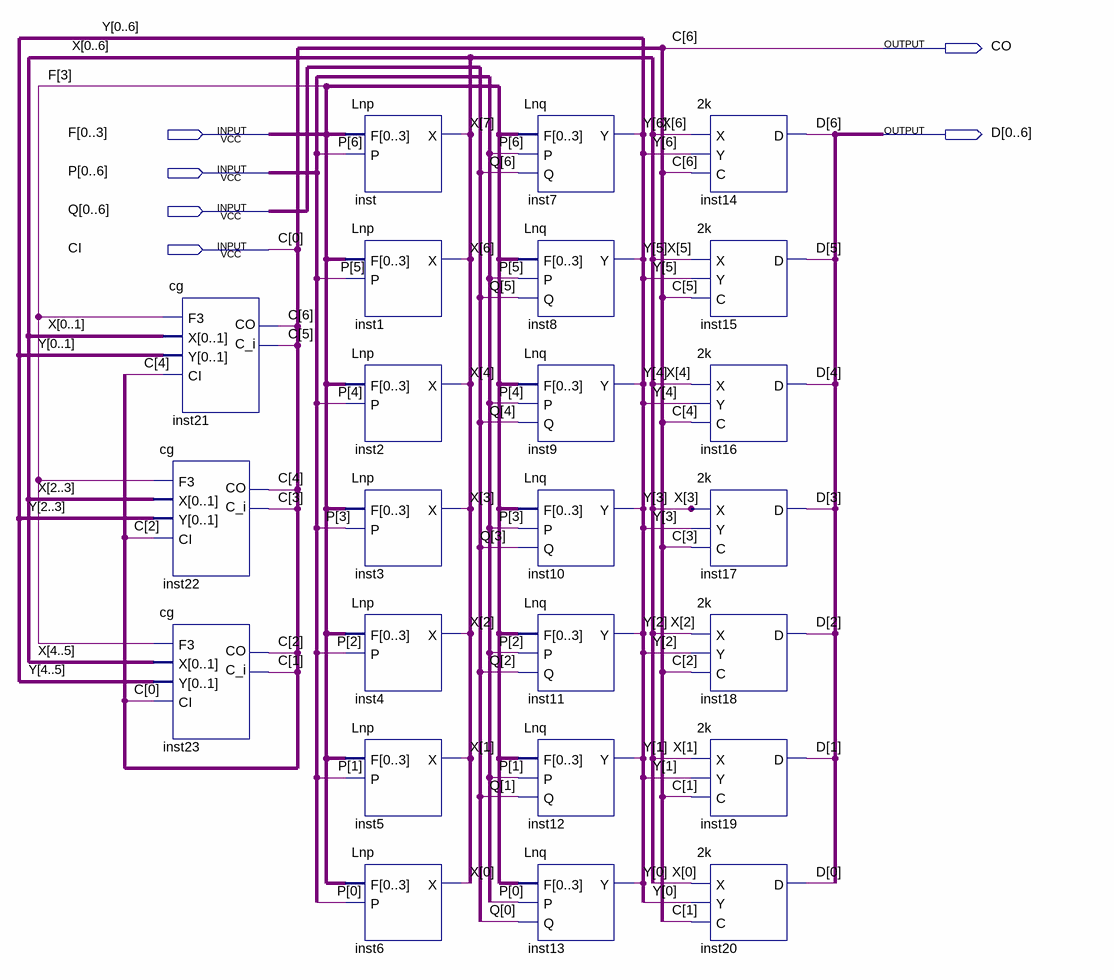
[diagram p0: schematic sheet]
// Quartus schematic lsm_7.bdf as structural Verilog: 24 symbols, 6 pins
module lsm_7 (
  input  [0:3] F,
  input  [0:6] P,
  input  [0:6] Q,
  input  CI,
  output CO,
  output [0:6] D
);

  wire [5:1] C;
  wire [6:0] Y;
  wire [7:0] X;

  cg inst21 (.F3(F[3]), .X({X[0], X[1]}), .Y({Y[0], Y[1]}), .CI(C[4]), .C_i(C[5]), .CO(CO));
  cg inst22 (.F3(F[3]), .X({X[2], X[3]}), .Y({Y[2], Y[3]}), .CI(C[2]), .C_i(C[3]), .CO(C[4]));
  cg inst23 (.F3(F[3]), .X({X[4], X[5]}), .Y({Y[4], Y[5]}), .CI(CI), .C_i(C[1]), .CO(C[2]));
  Lnp inst (.F(F), .P(P[6]), .X(X[7]));
  Lnp inst1 (.F(F), .P(P[5]), .X(X[6]));
  Lnp inst2 (.F(F), .P(P[4]), .X(X[4]));
  Lnp inst3 (.F(F), .P(P[3]), .X(X[3]));
  Lnp inst4 (.F(F), .P(P[2]), .X(X[2]));
  Lnp inst5 (.F(F), .P(P[1]), .X(X[1]));
  Lnp inst6 (.F(F), .P(P[0]), .X(X[0]));
  Lnq inst7 (.F(F), .P(P[6]), .Q(Q[6]), .Y(Y[6]));
  Lnq inst8 (.F(F), .P(P[5]), .Q(Q[5]), .Y(Y[5]));
  Lnq inst9 (.F(F), .P(P[4]), .Q(Q[4]), .Y(Y[4]));
  Lnq inst10 (.F(F), .P(P[3]), .Q(Q[3]), .Y(Y[3]));
  Lnq inst11 (.F(F), .P(P[2]), .Q(Q[2]), .Y(Y[2]));
  Lnq inst12 (.F(F), .P(P[1]), .Q(Q[1]), .Y(Y[1]));
  Lnq inst13 (.F(F), .P(P[0]), .Q(Q[0]), .Y(Y[0]));
  \2k  inst14 (.X(X[6]), .Y(Y[6]), .C(CO), .D(D[6]));
  \2k  inst15 (.X(X[5]), .Y(Y[5]), .C(C[5]), .D(D[5]));
  \2k  inst16 (.X(X[4]), .Y(Y[4]), .C(C[4]), .D(D[4]));
  \2k  inst17 (.X(X[3]), .Y(Y[3]), .C(C[3]), .D(D[3]));
  \2k  inst18 (.X(X[2]), .Y(Y[2]), .C(C[2]), .D(D[2]));
  \2k  inst19 (.X(X[1]), .Y(Y[1]), .C(C[1]), .D(D[1]));
  \2k  inst20 (.X(X[0]), .Y(Y[0]), .C(C[1]), .D(D[0]));

  // Other names for the same wires on the sheet: C (some bits) = {CO, CI}
endmodule
